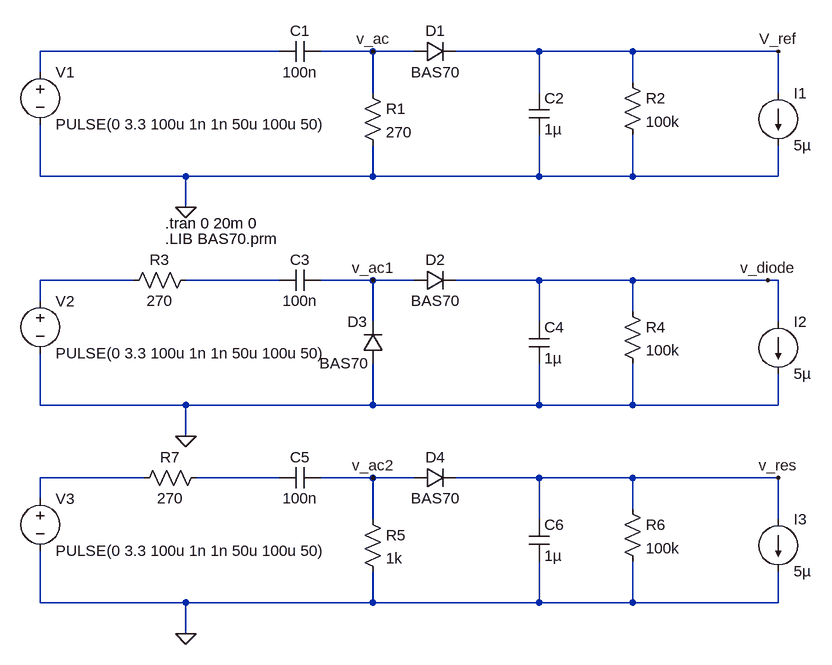
[diagram p0: schematic Kill_Switch.asc]
Kill_Switch.asc, the LTspice schematic file:
Version 4
SHEET 1 880 1060
WIRE 0 112 -368 112
WIRE 144 112 64 112
WIRE 208 112 144 112
WIRE 400 112 272 112
WIRE 544 112 400 112
WIRE 768 112 544 112
WIRE -368 144 -368 112
WIRE 544 160 544 112
WIRE 144 176 144 112
WIRE 400 176 400 112
WIRE 768 176 768 112
WIRE -368 304 -368 224
WIRE -144 304 -368 304
WIRE 144 304 144 256
WIRE 144 304 -144 304
WIRE 400 304 400 240
WIRE 400 304 144 304
WIRE 544 304 544 240
WIRE 544 304 400 304
WIRE 768 304 768 256
WIRE 768 304 544 304
WIRE -144 352 -144 304
WIRE -224 464 -368 464
WIRE 0 464 -144 464
WIRE 144 464 64 464
WIRE 208 464 144 464
WIRE 400 464 272 464
WIRE 544 464 400 464
WIRE 752 464 544 464
WIRE 768 464 752 464
WIRE -368 496 -368 464
WIRE 544 512 544 464
WIRE 144 528 144 464
WIRE 400 528 400 464
WIRE 768 528 768 464
WIRE -368 656 -368 576
WIRE -144 656 -368 656
WIRE 144 656 144 592
WIRE 144 656 -144 656
WIRE 400 656 400 592
WIRE 400 656 144 656
WIRE 544 656 544 592
WIRE 544 656 400 656
WIRE 768 656 768 608
WIRE 768 656 544 656
WIRE -144 704 -144 656
WIRE -208 768 -368 768
WIRE 0 768 -128 768
WIRE 144 768 64 768
WIRE 208 768 144 768
WIRE 400 768 272 768
WIRE 544 768 400 768
WIRE 768 768 544 768
WIRE -368 800 -368 768
WIRE 544 816 544 768
WIRE 144 832 144 768
WIRE 400 832 400 768
WIRE 768 832 768 768
WIRE -368 960 -368 880
WIRE -144 960 -368 960
WIRE 144 960 144 912
WIRE 144 960 -144 960
WIRE 400 960 400 896
WIRE 400 960 144 960
WIRE 544 960 544 896
WIRE 544 960 400 960
WIRE 768 960 768 912
WIRE 768 960 544 960
WIRE -144 1008 -144 960
FLAG -144 352 0
FLAG 144 112 v_ac
FLAG -144 704 0
FLAG 144 464 v_ac1
FLAG -144 1008 0
FLAG 144 768 v_ac2
FLAG 768 112 V_ref
FLAG 752 464 v_diode
FLAG 768 768 v_res
SYMBOL voltage -368 128 R0
WINDOW 123 0 0 Left 0
WINDOW 39 0 0 Left 0
SYMATTR InstName V1
SYMATTR Value PULSE(0 3.3 100u 1n 1n 50u 100u 50)
SYMBOL cap 64 96 R90
WINDOW 0 0 32 VBottom 2
WINDOW 3 32 32 VTop 2
SYMATTR InstName C1
SYMATTR Value 100n
SYMBOL res 128 160 R0
SYMATTR InstName R1
SYMATTR Value 270
SYMBOL cap 384 176 R0
SYMATTR InstName C2
SYMATTR Value 1µ
SYMBOL res 528 144 R0
SYMATTR InstName R2
SYMATTR Value 100k
SYMBOL diode 208 128 R270
WINDOW 0 32 32 VTop 2
WINDOW 3 0 32 VBottom 2
SYMATTR InstName D1
SYMATTR Value BAS70
SYMATTR Prefix X
SYMBOL current 768 176 R0
SYMATTR InstName I1
SYMATTR Value 5µ
SYMBOL voltage -368 480 R0
WINDOW 123 0 0 Left 0
WINDOW 39 0 0 Left 0
SYMATTR InstName V2
SYMATTR Value PULSE(0 3.3 100u 1n 1n 50u 100u 50)
SYMBOL cap 64 448 R90
WINDOW 0 0 32 VBottom 2
WINDOW 3 32 32 VTop 2
SYMATTR InstName C3
SYMATTR Value 100n
SYMBOL cap 384 528 R0
SYMATTR InstName C4
SYMATTR Value 1µ
SYMBOL res 528 496 R0
SYMATTR InstName R4
SYMATTR Value 100k
SYMBOL diode 208 480 R270
WINDOW 0 32 32 VTop 2
WINDOW 3 0 32 VBottom 2
SYMATTR InstName D2
SYMATTR Value BAS70
SYMATTR Prefix X
SYMBOL current 768 528 R0
SYMATTR InstName I2
SYMATTR Value 5µ
SYMBOL diode 160 592 R180
WINDOW 0 24 64 Left 2
WINDOW 3 24 0 Left 2
SYMATTR InstName D3
SYMATTR Value BAS70
SYMATTR Prefix X
SYMBOL res -128 448 R90
WINDOW 0 0 56 VBottom 2
WINDOW 3 32 56 VTop 2
SYMATTR InstName R3
SYMATTR Value 270
SYMBOL voltage -368 784 R0
WINDOW 123 0 0 Left 0
WINDOW 39 0 0 Left 0
SYMATTR InstName V3
SYMATTR Value PULSE(0 3.3 100u 1n 1n 50u 100u 50)
SYMBOL cap 64 752 R90
WINDOW 0 0 32 VBottom 2
WINDOW 3 32 32 VTop 2
SYMATTR InstName C5
SYMATTR Value 100n
SYMBOL res 128 816 R0
SYMATTR InstName R5
SYMATTR Value 1k
SYMBOL cap 384 832 R0
SYMATTR InstName C6
SYMATTR Value 1µ
SYMBOL res 528 800 R0
SYMATTR InstName R6
SYMATTR Value 100k
SYMBOL diode 208 784 R270
WINDOW 0 32 32 VTop 2
WINDOW 3 0 32 VBottom 2
SYMATTR InstName D4
SYMATTR Value BAS70
SYMATTR Prefix X
SYMBOL current 768 832 R0
SYMATTR InstName I3
SYMATTR Value 5µ
SYMBOL res -112 752 R90
WINDOW 0 0 56 VBottom 2
WINDOW 3 32 56 VTop 2
SYMATTR InstName R7
SYMATTR Value 270
TEXT -176 376 Left 2 !.tran 0 20m 0
TEXT -176 400 Left 2 !.LIB BAS70.prm

The netlist it stands for:
* Kill_Switch.asc
V1 N001 0 PULSE(0 3.3 100u 1n 1n 50u 100u 50)
C1 v_ac N001 100n
R1 v_ac 0 270
C2 V_ref 0 1µ
R2 V_ref 0 100k
XD1 v_ac V_ref BAS70  ; pins + -
I1 V_ref 0 5µ
V2 N002 0 PULSE(0 3.3 100u 1n 1n 50u 100u 50)
C3 v_ac1 N003 100n
C4 v_diode 0 1µ
R4 v_diode 0 100k
XD2 v_ac1 v_diode BAS70  ; pins + -
I2 v_diode 0 5µ
XD3 0 v_ac1 BAS70  ; pins + -
R3 N003 N002 270
V3 N004 0 PULSE(0 3.3 100u 1n 1n 50u 100u 50)
C5 v_ac2 N005 100n
R5 v_ac2 0 1k
C6 v_res 0 1µ
R6 v_res 0 100k
XD4 v_ac2 v_res BAS70  ; pins + -
I3 v_res 0 5µ
R7 N005 N004 270
.tran 0 20m 0
.LIB BAS70.prm
.backanno
.end